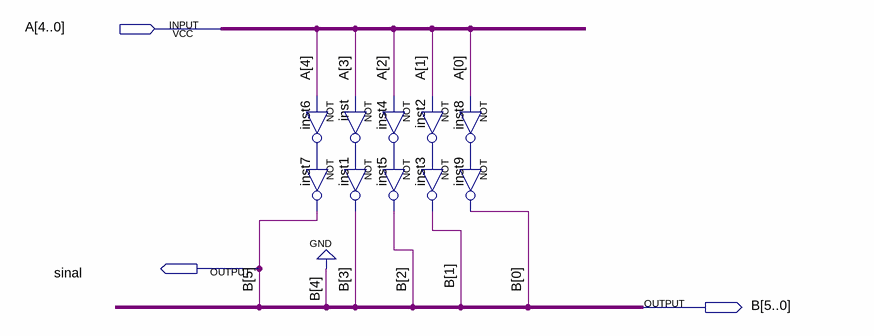
[diagram p0: schematic sheet]
// Quartus schematic adiciona_1bit.bdf as structural Verilog: 10 symbols, 3 pins
module adiciona_1bit (
  input  [4:0] A,
  output sinal,
  output [5:0] B
);

  wire inst2_out, inst4_out, inst6_out, inst8_out, inst_out;

  not inst (inst_out, A[3]);
  not inst6 (inst6_out, A[4]);
  not inst1 (B[3], inst_out);
  not inst7 (B[5], inst6_out);
  not inst2 (inst2_out, A[1]);
  not inst4 (inst4_out, A[2]);
  not inst3 (B[1], inst2_out);
  not inst5 (B[2], inst4_out);
  not inst8 (inst8_out, A[0]);
  not inst9 (B[0], inst8_out);

  assign B[4] = 1'b0;
  assign sinal = B[5];
endmodule
